# Altium schematic sheet GSM Modem Antenna.SchDoc: GSM 2G Antenna Filter
size 292 x 193 mm; DocumentNumber: 14; SheetNumber: 34; SheetTotal: 40
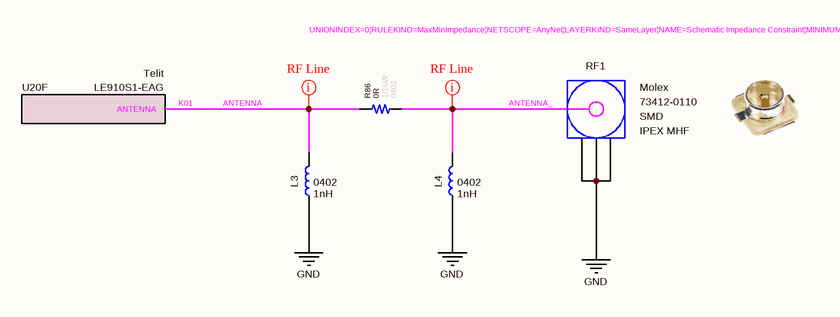
[diagram p0: GSM Modem Antenna.SchDoc]

## Parts
L3  value 1nH  Case: 0402  [INDUCTOR_0402]  (hidden comment: Fixed Inductor)
L4  value 1nH  Case: 0402  [INDUCTOR_0402]  (hidden comment: Fixed Inductor)
R86  value 0R  Case: 0402  Power: 1/16W  [RESISTOR_0402]  (hidden comment: 0R - 0402 - %1 - 1/16W)
RF1  Connector Type: IPEX MHF  Case: SMD  Manufacturer Name: Molex  [Connector_IPEX]  (hidden comment: 73412-0110)
U20  Manufacturer Part Number: LE910S1-EAG  Manufacturer Name: Telit  [LE910 GSM Modem]  (hidden comment: LE910S1-EAG LTE GSM Module)  (part F of 19)

## Nets
GND: L3.1 L4.1 RF1.2(GND) RF1.3(GND) RF1.4(GND)
ANTENNA: L3.2 R86.2 U20.K01(ANTENNA)
ANTENNA_: L4.2 R86.1 RF1.1(Signal)

## Layout directives
rule Impedance Constraint [Min = 49.00    Max = 50.00    ]: ANTENNA, ANTENNA_

## Notes on the sheet
- © 2021 All rights reserved.
  This document may not, in whole or in part, be copied, photocopied, reproduced, translated or converted to any electronic or machine readable from without prior written permission of Mehmet Günce Akkoyun.
  Engineer contact : akkoyun@me.com
- Property of
- Engineer :
- Date :
- Size :
- A4
- Time :
- Project :
- Page :
- /
- Customer :
- Product ID :
- Module ID :
- Version :
- File :
- Revision :

## Library data of the parts
L3 L4 = Inductor - 1nH [0402]: Manufacturer Name: Murata Electronics; Manufacturer Part Number: LQG15HN1N0S02D; Tolerance: 0.3 nH; Height: 0.35mm; ComponentLink1Description: DataSheet; ComponentLink1URL: https://www.mouser.com.tr/datasheet/2/281/JELF243B-0009-1699631.pdf
R86 = Resistor - 0R [0402]: Thick Film Resistors - SMD 1/16 W 0 Ohm; Manufacturer Name: Vishay; Manufacturer Part Number: CRCW04020000Z0ED; ComponentLink1Description: DataSheet; ComponentLink1URL: https://www.mouser.com.tr/datasheet/2/427/dcrcwe3-1762152.pdf; ComponentLink2Description: Mouser; ComponentLink2URL: https://www.mouser.com.tr/ProductDetail/Vishay-Dale/CRCW04020000Z0ED?qs=sGAEpiMZZMu61qfTUdNhG2DpbjADlD3GG34cJb50zyg%3D
RF1 = Connector - IPEX MHF: MOLEX   73412-0110   RF COAXIAL, MICROCOAXIAL, JACK, 50OHM; ROHS: Yes; Product Type: RF Connectors; Impedance: 50 Ohm; Manufacturer Part Number: 73412-0110
U20 = IC - LE910S1-EAG: Telit LE910S1-EAG GPRS/GNSS Module; Case: BGA